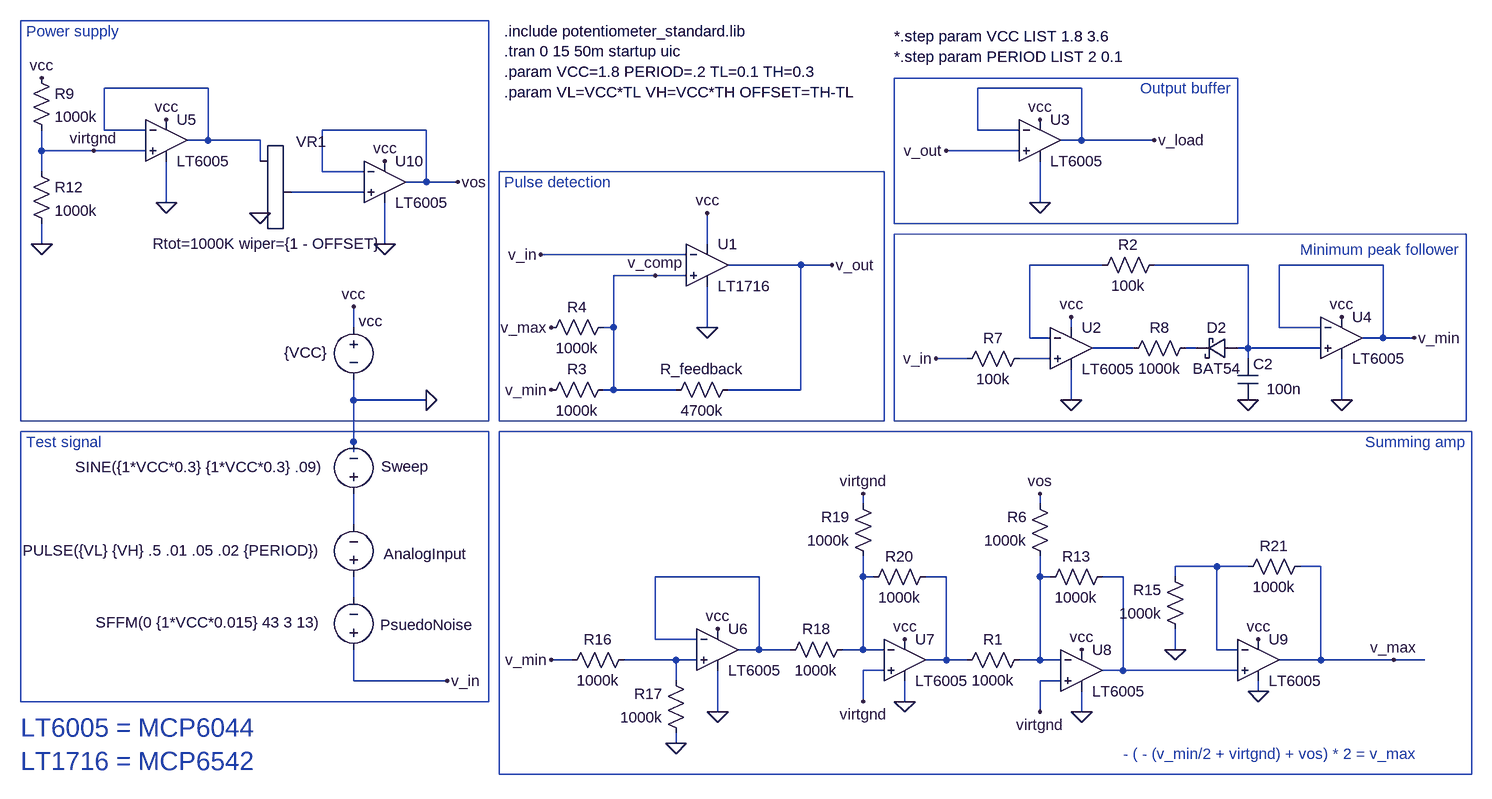
[diagram p0: schematic input-stage2.asc]
input-stage2.asc, the LTspice schematic file:
Version 4
SHEET 1 2788 5112
WIRE -576 -400 -736 -400
WIRE 768 -400 608 -400
WIRE -736 -336 -736 -400
WIRE -672 -336 -736 -336
WIRE -240 -336 -400 -336
WIRE 608 -336 608 -400
WIRE 672 -336 608 -336
WIRE -576 -320 -576 -400
WIRE -576 -320 -608 -320
WIRE -496 -320 -576 -320
WIRE 768 -320 768 -400
WIRE 768 -320 736 -320
WIRE 880 -320 768 -320
WIRE -832 -304 -832 -336
WIRE -752 -304 -832 -304
WIRE -672 -304 -752 -304
WIRE 672 -304 560 -304
WIRE -496 -288 -496 -320
WIRE -832 -272 -832 -304
WIRE -400 -272 -400 -336
WIRE -336 -272 -400 -272
WIRE -240 -256 -240 -336
WIRE -240 -256 -272 -256
WIRE -192 -256 -240 -256
WIRE -336 -240 -448 -240
WIRE -640 -224 -640 -288
WIRE 704 -224 704 -288
WIRE -832 -160 -832 -192
WIRE -304 -160 -304 -224
WIRE 192 -160 192 -208
WIRE 160 -144 -64 -144
WIRE 336 -128 224 -128
WIRE 384 -128 336 -128
WIRE 800 -128 688 -128
WIRE 1024 -128 880 -128
WIRE 1232 -128 1072 -128
WIRE 112 -112 48 -112
WIRE 160 -112 112 -112
WIRE -352 -32 -352 -64
WIRE 48 -32 48 -112
WIRE 48 -32 32 -32
WIRE 192 -32 192 -96
WIRE 752 -32 752 -48
WIRE 1072 -32 1072 -128
WIRE 1136 -32 1072 -32
WIRE 688 -16 688 -128
WIRE 720 -16 688 -16
WIRE 1232 -16 1232 -128
WIRE 1232 -16 1200 -16
WIRE 1280 -16 1232 -16
WIRE 848 0 784 0
WIRE 944 0 928 0
WIRE 1024 0 1024 -128
WIRE 1024 0 1008 0
WIRE 1136 0 1024 0
WIRE 592 16 544 16
WIRE 720 16 672 16
WIRE 1024 16 1024 0
WIRE 48 64 48 -32
WIRE 48 64 32 64
WIRE 144 64 48 64
WIRE 336 64 336 -128
WIRE 336 64 224 64
WIRE -352 80 -352 48
WIRE -240 80 -352 80
WIRE 752 80 752 32
WIRE 1168 80 1168 16
WIRE -352 144 -352 80
WIRE -352 160 -352 144
WIRE 432 240 432 224
WIRE 704 240 704 224
WIRE -352 272 -352 224
WIRE 976 336 912 336
WIRE 1024 336 976 336
WIRE 1136 336 1104 336
WIRE 272 352 112 352
WIRE 432 352 432 320
WIRE 448 352 432 352
WIRE 560 352 528 352
WIRE 704 352 704 320
WIRE 720 352 704 352
WIRE 832 352 800 352
WIRE 912 352 912 336
WIRE -352 384 -352 352
WIRE 112 448 112 352
WIRE 176 448 112 448
WIRE 272 464 272 352
WIRE 272 464 240 464
WIRE 320 464 272 464
WIRE 432 464 432 352
WIRE 432 464 400 464
WIRE 464 464 432 464
WIRE 912 464 912 432
WIRE 976 464 976 336
WIRE 1008 464 976 464
WIRE -16 480 -48 480
WIRE 144 480 64 480
WIRE 176 480 144 480
WIRE 560 480 560 352
WIRE 560 480 528 480
WIRE 592 480 560 480
WIRE 704 480 704 352
WIRE 704 480 672 480
WIRE 736 480 704 480
WIRE 1136 480 1136 336
WIRE 1136 480 1072 480
WIRE 1248 480 1136 480
WIRE 1296 480 1248 480
WIRE 464 496 432 496
WIRE 832 496 832 352
WIRE 832 496 800 496
WIRE 1008 496 832 496
WIRE -352 512 -352 464
WIRE -208 512 -352 512
WIRE 144 512 144 480
WIRE 736 512 704 512
WIRE 1040 528 1040 512
WIRE 432 544 432 496
WIRE 496 544 496 512
WIRE 208 560 208 496
WIRE 704 560 704 512
WIRE 768 560 768 528
WIRE 144 608 144 592
FLAG -240 80 0
FLAG -352 -64 vcc
FLAG 192 -208 vcc
FLAG 192 -32 0
FLAG 752 80 0
FLAG 752 -48 vcc
FLAG 1024 80 0
FLAG 1280 -16 v_min
FLAG -64 -144 v_in
FLAG 384 -128 v_out
FLAG -48 -32 v_max
FLAG -48 64 v_min
FLAG 704 -352 vcc
FLAG 704 -224 0
FLAG 112 -112 v_comp
FLAG 1168 -48 vcc
FLAG 1168 80 0
FLAG 768 464 vcc
FLAG 768 560 0
FLAG 1040 448 vcc
FLAG 704 560 virtgnd
FLAG 912 464 0
FLAG 704 224 vos
FLAG 1248 480 v_max
FLAG 208 432 vcc
FLAG 208 560 0
FLAG 144 608 0
FLAG 496 448 vcc
FLAG 496 544 0
FLAG 432 544 virtgnd
FLAG 432 224 virtgnd
FLAG 1040 528 0
FLAG 880 -320 v_load
FLAG -208 512 v_in
FLAG 560 -304 v_out
FLAG 544 16 v_in
FLAG -48 480 v_min
FLAG -832 -416 vcc
FLAG -496 -208 0
FLAG -192 -256 vos
FLAG -832 -160 0
FLAG -640 -352 vcc
FLAG -640 -224 0
FLAG -752 -304 virtgnd
FLAG -304 -288 vcc
FLAG -304 -160 0
DATAFLAG 1296 480 ""
SYMBOL voltage -352 -48 R0
WINDOW 3 -107 55 Left 2
WINDOW 123 0 0 Left 2
WINDOW 39 0 0 Left 2
WINDOW 0 8 6 Left 2
SYMATTR Value {VCC}
SYMATTR InstName vcc
SYMBOL res 128 80 R270
WINDOW 0 32 56 VTop 2
WINDOW 3 0 56 VBottom 2
SYMATTR InstName R_feedback
SYMATTR Value 4700k
SYMATTR SpiceLine tol=2 pwr=0.25
SYMBOL res 48 48 R90
WINDOW 0 0 56 VBottom 2
WINDOW 3 32 56 VTop 2
SYMATTR InstName R3
SYMATTR Value 1000k
SYMATTR SpiceLine tol=2 pwr=0.25
SYMBOL res -64 -16 R270
WINDOW 0 32 56 VTop 2
WINDOW 3 0 56 VBottom 2
SYMATTR InstName R4
SYMATTR Value 1000k
SYMATTR SpiceLine tol=2 pwr=0.25
SYMBOL voltage -352 480 R180
WINDOW 0 -113 70 Bottom 2
WINDOW 3 47 58 Left 2
WINDOW 123 0 0 Left 2
WINDOW 39 93 56 VBottom 2
SYMATTR InstName PsuedoNoise
SYMATTR Value SFFM(0 {1*VCC*0.015} 43 3 13)
SYMBOL schottky 1008 -16 R90
WINDOW 0 0 32 VBottom 2
WINDOW 3 32 32 VTop 2
SYMATTR InstName D2
SYMATTR Value BAT54
SYMATTR Description Diode
SYMATTR Type diode
SYMBOL cap 1008 16 R0
WINDOW 3 45 47 Left 2
SYMATTR Value 100n
SYMATTR InstName C2
SYMBOL res 896 -144 R90
WINDOW 0 0 56 VBottom 2
WINDOW 3 32 56 VTop 2
SYMATTR InstName R2
SYMATTR Value 100k
SYMATTR SpiceLine tol=2 pwr=0.25
SYMBOL res 688 0 R90
WINDOW 0 0 56 VBottom 2
WINDOW 3 32 56 VTop 2
SYMATTR InstName R7
SYMATTR Value 100k
SYMATTR SpiceLine tol=2 pwr=0.25
SYMBOL voltage -352 368 R180
WINDOW 0 -111 67 Bottom 2
WINDOW 3 49 57 Left 2
WINDOW 123 0 0 Left 2
WINDOW 39 0 0 Left 2
SYMATTR InstName AnalogInput
SYMATTR Value PULSE({VL} {VH} .5 .01 .05 .02 {PERIOD})
SYMBOL voltage -352 240 R180
WINDOW 0 -116 58 Left 2
WINDOW 3 45 57 Left 2
WINDOW 123 0 0 Left 2
WINDOW 39 0 0 Left 2
SYMATTR InstName Sweep
SYMATTR Value SINE({1*VCC*0.3} {1*VCC*0.3} .09)
SYMBOL res 688 464 R90
WINDOW 0 0 56 VBottom 2
WINDOW 3 32 56 VTop 2
SYMATTR InstName R1
SYMATTR Value 1000k
SYMATTR SpiceLine tol=2 pwr=0.25
SYMBOL res 720 336 R180
WINDOW 0 36 76 Left 2
WINDOW 3 36 40 Left 2
SYMATTR InstName R6
SYMATTR Value 1000k
SYMATTR SpiceLine tol=2 pwr=0.25
SYMBOL res 816 336 R90
WINDOW 0 0 56 VBottom 2
WINDOW 3 32 56 VTop 2
SYMATTR InstName R13
SYMATTR Value 1000k
SYMATTR SpiceLine tol=2 pwr=0.25
SYMBOL res 80 464 R90
WINDOW 0 0 56 VBottom 2
WINDOW 3 32 56 VTop 2
SYMATTR InstName R16
SYMATTR Value 1000k
SYMATTR SpiceLine tol=2 pwr=0.25
SYMBOL res 160 608 R180
WINDOW 0 36 76 Left 2
WINDOW 3 36 40 Left 2
SYMATTR InstName R17
SYMATTR Value 1000k
SYMATTR SpiceLine tol=2 pwr=0.25
SYMBOL res 416 448 R90
WINDOW 0 0 56 VBottom 2
WINDOW 3 32 56 VTop 2
SYMATTR InstName R18
SYMATTR Value 1000k
SYMATTR SpiceLine tol=2 pwr=0.25
SYMBOL res 448 336 R180
WINDOW 0 36 76 Left 2
WINDOW 3 36 40 Left 2
SYMATTR InstName R19
SYMATTR Value 1000k
SYMATTR SpiceLine tol=2 pwr=0.25
SYMBOL res 544 336 R90
WINDOW 0 0 56 VBottom 2
WINDOW 3 32 56 VTop 2
SYMATTR InstName R20
SYMATTR Value 1000k
SYMATTR SpiceLine tol=2 pwr=0.25
SYMBOL res 928 448 R180
WINDOW 0 36 76 Left 2
WINDOW 3 36 40 Left 2
SYMATTR InstName R15
SYMATTR Value 1000k
SYMATTR SpiceLine tol=2 pwr=0.25
SYMBOL res 1120 320 R90
WINDOW 0 0 56 VBottom 2
WINDOW 3 32 56 VTop 2
SYMATTR InstName R21
SYMATTR Value 1000k
SYMATTR SpiceLine tol=2 pwr=0.25
SYMBOL res 944 -16 R90
WINDOW 0 0 56 VBottom 2
WINDOW 3 32 56 VTop 2
SYMATTR InstName R8
SYMATTR Value 1000k
SYMATTR SpiceLine tol=2 pwr=0.25
SYMBOL Opamps\\LT6005 752 0 R0
SYMATTR InstName U2
SYMBOL Opamps\\LT6005 704 -320 R0
SYMATTR InstName U3
SYMBOL Opamps\\LT6005 1168 -16 R0
SYMATTR InstName U4
SYMBOL Opamps\\LT6005 208 464 R0
SYMATTR InstName U6
SYMBOL Opamps\\LT6005 496 480 R0
SYMATTR InstName U7
SYMBOL Opamps\\LT6005 768 496 R0
SYMATTR InstName U8
SYMBOL Opamps\\LT6005 1040 480 R0
SYMATTR InstName U9
SYMBOL res -848 -432 R0
SYMATTR InstName R9
SYMATTR Value 1000k
SYMATTR SpiceLine tol=2 pwr=0.25
SYMBOL res -848 -288 R0
SYMATTR InstName R12
SYMATTR Value 1000k
SYMATTR SpiceLine tol=2 pwr=0.25
SYMBOL Opamps\\LT6005 -640 -320 R0
SYMATTR InstName U5
SYMBOL Opamps\\LT6005 -304 -256 R0
SYMATTR InstName U10
SYMBOL potentiometer_standard -512 -304 R0
WINDOW 3 -149 143 Left 2
WINDOW 39 48 112 Invisible 2
SYMATTR Value Rtot=1000K wiper={1 - OFFSET}
SYMATTR SpiceLine ""
SYMATTR InstName VR1
SYMBOL Comparators\\LT1716 192 -128 R0
SYMATTR InstName U1
TEXT -120 -488 Left 2 !.include potentiometer_standard.lib\n.tran 0 15 50m startup uic\n.param VCC=1.8 PERIOD=.2 TL=0.1 TH=0.3\n.param VL=VCC*TL VH=VCC*TH OFFSET=TH-TL
TEXT -856 144 Left 2 ;Test signal
TEXT -120 -256 Left 2 ;Pulse detection
TEXT 1352 -152 Right 2 ;Minimum peak follower
TEXT 1000 -400 Right 2 ;Output buffer
TEXT 1360 144 Right 2 ;Summing amp
TEXT -864 584 Left 4 ;LT6005 = MCP6044\nLT1716 = MCP6542
TEXT 832 624 Left 2 ;- ( - (v_min/2 + virtgnd) + vos) * 2 = v_max
TEXT -856 -488 Left 2 ;Power supply
TEXT 480 -480 Left 2 !*.step param VCC LIST 1.8 3.6\n*.step param PERIOD LIST 2 0.1
RECTANGLE Normal -144 544 -864 128
RECTANGLE Normal 464 -272 -128 112
RECTANGLE Normal 1360 112 480 -176
RECTANGLE Normal 1008 -192 480 -416
RECTANGLE Normal 1368 656 -128 128
RECTANGLE Normal -144 112 -864 -504

The netlist it stands for:
* input-stage2.asc
vcc vcc 0 {VCC}
R_feedback v_comp v_out 4700k tol=2 pwr=0.25
R3 v_comp v_min 1000k tol=2 pwr=0.25
R4 v_max v_comp 1000k tol=2 pwr=0.25
V§PsuedoNoise v_in N015 SFFM(0 {1*VCC*0.015} 43 3 13)
D2 N004 N006 BAT54
C2 N004 0 100n
R2 N004 N003 100k tol=2 pwr=0.25
R7 N007 v_in 100k tol=2 pwr=0.25
V§AnalogInput N015 N008 PULSE({VL} {VH} .5 .01 .05 .02 {PERIOD})
V§Sweep N008 0 SINE({1*VCC*0.3} {1*VCC*0.3} .09)
R1 N013 N012 1000k tol=2 pwr=0.25
R6 N013 vos 1000k tol=2 pwr=0.25
R13 N014 N013 1000k tol=2 pwr=0.25
R16 N016 v_min 1000k tol=2 pwr=0.25
R17 0 N016 1000k tol=2 pwr=0.25
R18 N011 N010 1000k tol=2 pwr=0.25
R19 N011 virtgnd 1000k tol=2 pwr=0.25
R20 N012 N011 1000k tol=2 pwr=0.25
R15 0 N009 1000k tol=2 pwr=0.25
R21 v_max N009 1000k tol=2 pwr=0.25
R8 N006 N005 1000k tol=2 pwr=0.25
* U2: LT6005 (symbol Opamps\LT6005 not available, pins judged from their places): In+=N007 In-=N003 V+=vcc V-=0 OUT=N005
* U3: LT6005 (symbol Opamps\LT6005 not available, pins judged from their places): In+=v_out In-=v_load V+=vcc V-=0 OUT=v_load
* U4: LT6005 (symbol Opamps\LT6005 not available, pins judged from their places): In+=N004 In-=v_min V+=vcc V-=0 OUT=v_min
* U6: LT6005 (symbol Opamps\LT6005 not available, pins judged from their places): In+=N016 In-=N010 V+=vcc V-=0 OUT=N010
* U7: LT6005 (symbol Opamps\LT6005 not available, pins judged from their places): In+=virtgnd In-=N011 V+=vcc V-=0 OUT=N012
* U8: LT6005 (symbol Opamps\LT6005 not available, pins judged from their places): In+=virtgnd In-=N013 V+=vcc V-=0 OUT=N014
* U9: LT6005 (symbol Opamps\LT6005 not available, pins judged from their places): In+=N014 In-=N009 V+=vcc V-=0 OUT=v_max
R9 vcc virtgnd 1000k tol=2 pwr=0.25
R12 virtgnd 0 1000k tol=2 pwr=0.25
* U5: LT6005 (symbol Opamps\LT6005 not available, pins judged from their places): In+=virtgnd In-=N001 V+=vcc V-=0 OUT=N001
* U10: LT6005 (symbol Opamps\LT6005 not available, pins judged from their places): In+=N002 In-=vos V+=vcc V-=0 OUT=vos
XVR1 N001 0 N002 Rtot=1000K wiper={1 - OFFSET}
XU1 v_comp v_in vcc 0 v_out LT1716  ; pins In+ In- V+ V- OUT
.model D D
.lib standard.dio
.include potentiometer_standard.lib
.tran 0 15 50m startup uic
.param VCC=1.8 PERIOD=.2 TL=0.1 TH=0.3
.param VL=VCC*TL VH=VCC*TH OFFSET=TH-TL
* Test signal
* Pulse detection
* Minimum peak follower
* Output buffer
* Summing amp
* LT6005 = MCP6044
* LT1716 = MCP6542
* - ( - (v_min/2 + virtgnd) + vos) * 2 = v_max
* Power supply
*.step param VCC LIST 1.8 3.6
*.step param PERIOD LIST 2 0.1
.lib LTC1.lib
.backanno
.end